# Altium schematic sheet Sheet1.SchDoc
size A; SheetNumber: 1; SheetTotal: 1
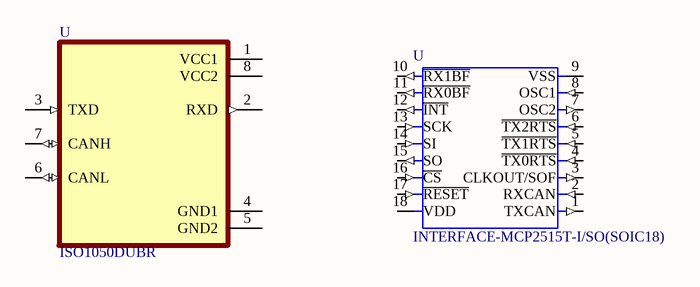
[diagram p0: Sheet1.SchDoc]

## Parts
(Parts that share a designator on the sheet are numbered #1, #2 ... from top to bottom, then left to right.)
U#1  ISO1050DUBR  [SOP254P1040X485-8N]
U#2  INTERFACE-MCP2515T-I/SO(SOIC18)  [SOIC18-1.27-11.5X7.5MM]

## Nets

Not connected (* = marked no-connect by the designer): U#1 1(VCC1) 2(RXD) 3(TXD) 4(GND1) 5(GND2) 6(CANL) 7(CANH) 8(VCC2); U#2 1(TXCAN) 2(RXCAN) 3(CLKOUT/SOF) 4(~{TX0RTS}) 5(~{TX1RTS}) 6(~{TX2RTS}) 7(OSC2) 8(OSC1) 9(VSS) 10(~{RX1BF}) 11(~{RX0BF}) 12(~{INT}) 13(SCK) 14(SI) 15(SO) 16(~{CS}) 17(~{RESET}) 18(VDD)

## Library data of the parts
U#1 = ISO1050DUBR: Isolated 5-V CAN transceiver 8-SOP -55 to 105; MF: Texas Instruments; Package: SOP-8 Texas Instruments; DigiKey-Purchase-URL: https://snapeda.com/shop?store=DigiKey&id=334036; MP: ISO1050DUBR; Mouser-Purchase-URL: https://snapeda.com/shop?store=Mouser&id=334036; Price: None; Availability: Good; Texas_Instruments-Purchase-URL: https://snapeda.com/shop?store=Texas+Instruments&id=334036; Arrow_Electronics-Purchase-URL: https://snapeda.com/shop?store=Arrow+Electronics&id=334036; Value: *; SnapEDA_Link: https://www.snapeda.com/parts/ISO1050DUBR/Texas%20Instruments/view-part/334036/?ref=snap
U#2 = INTERFACE-MCP2515T-I/SO(SOIC18): CANbus Controller CAN 2.0 SPI Interface 18-SOIC; MF: Microchip; MP: MCP2515T-I/SO; Availability: Unavailable; SnapEDA_Link: https://www.snapeda.com/parts/MCP2515T-I/SO/Microchip/view-part/105731/?ref=snap; Package: SOIC-18 Microchip; Value: *; Price: None